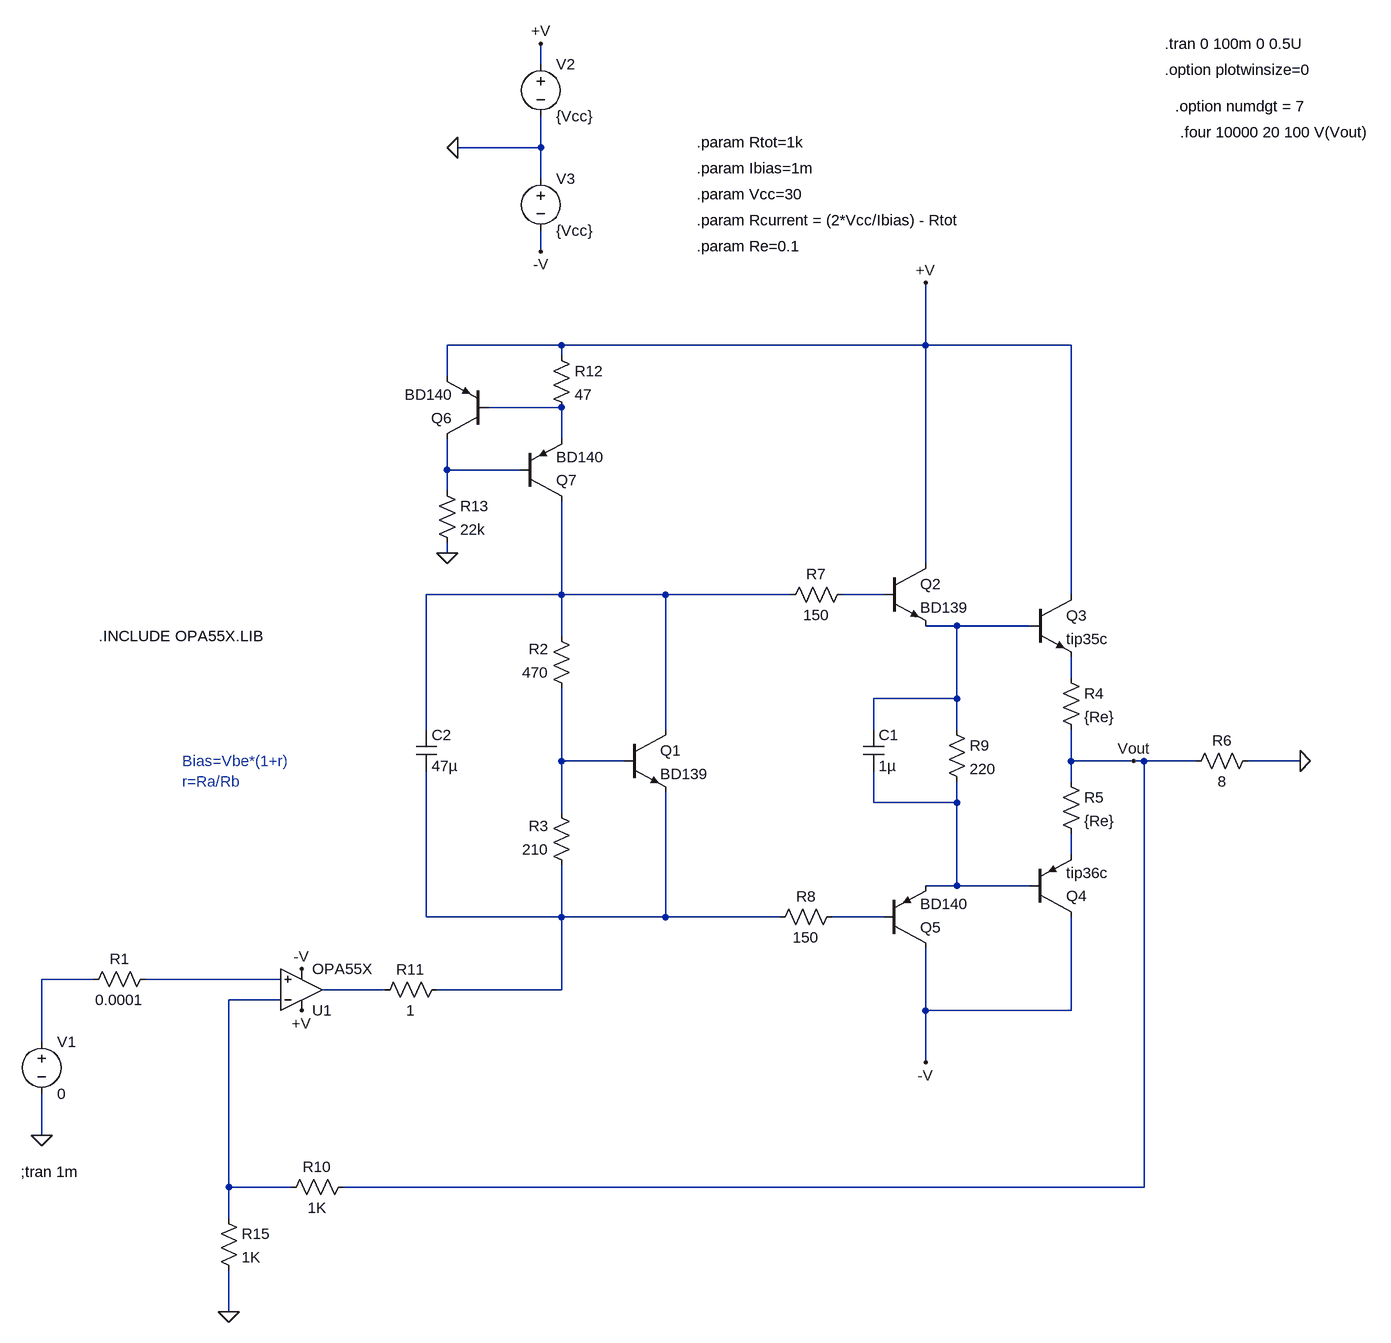
[diagram p0: schematic V2 - DC.asc]
V2 - DC.asc, the LTspice schematic file:
Version 4
SHEET 1 1144 964
WIRE -160 -976 -160 -1008
WIRE -160 -848 -160 -896
WIRE -160 -848 -288 -848
WIRE -160 -800 -160 -848
WIRE -160 -688 -160 -720
WIRE -128 -544 -304 -544
WIRE 432 -544 432 -640
WIRE 432 -544 -128 -544
WIRE 656 -544 432 -544
WIRE -128 -528 -128 -544
WIRE -304 -496 -304 -544
WIRE -128 -448 -240 -448
WIRE -128 -400 -128 -448
WIRE -304 -352 -304 -400
WIRE -192 -352 -304 -352
WIRE -304 -320 -304 -352
WIRE -304 -224 -304 -240
WIRE 432 -208 432 -544
WIRE -128 -160 -128 -304
WIRE -128 -160 -336 -160
WIRE 32 -160 -128 -160
WIRE 224 -160 32 -160
WIRE 368 -160 304 -160
WIRE 656 -160 656 -544
WIRE 480 -112 432 -112
WIRE 592 -112 480 -112
WIRE -128 -96 -128 -160
WIRE 656 -32 656 -64
WIRE 480 0 480 -112
WIRE 480 0 352 0
WIRE -336 48 -336 -160
WIRE 32 48 32 -160
WIRE 352 48 352 0
WIRE 480 48 480 0
WIRE -128 96 -128 -16
WIRE -32 96 -128 96
WIRE 656 96 656 48
WIRE 752 96 656 96
WIRE 768 96 752 96
WIRE 848 96 768 96
WIRE 1008 96 928 96
WIRE 656 128 656 96
WIRE 352 160 352 112
WIRE 480 160 480 128
WIRE 480 160 352 160
WIRE -128 176 -128 96
WIRE 656 240 656 208
WIRE 480 288 480 160
WIRE 480 288 432 288
WIRE 592 288 480 288
WIRE -336 336 -336 112
WIRE -128 336 -128 256
WIRE -128 336 -336 336
WIRE 32 336 32 144
WIRE 32 336 -128 336
WIRE 208 336 32 336
WIRE 368 336 288 336
WIRE -848 432 -928 432
WIRE -560 432 -768 432
WIRE -400 448 -496 448
WIRE -128 448 -128 336
WIRE -128 448 -320 448
WIRE -560 464 -640 464
WIRE 432 480 432 384
WIRE 656 480 656 336
WIRE 656 480 432 480
WIRE -928 528 -928 432
WIRE 432 560 432 480
WIRE -928 672 -928 608
WIRE -640 752 -640 464
WIRE -544 752 -640 752
WIRE 768 752 768 96
WIRE 768 752 -464 752
WIRE -640 800 -640 752
WIRE -640 944 -640 880
FLAG 432 -640 +V
FLAG 432 560 -V
FLAG -928 672 0
FLAG -288 -848 0
FLAG -160 -1008 +V
FLAG -160 -688 -V
FLAG 1008 96 0
FLAG 752 96 Vout
FLAG -528 480 +V
FLAG -528 416 -V
FLAG -304 -224 0
FLAG -640 944 0
SYMBOL voltage -928 512 R0
WINDOW 123 0 0 Left 0
WINDOW 39 0 0 Left 0
SYMATTR InstName V1
SYMATTR Value 0
SYMBOL res -752 416 R90
WINDOW 0 0 56 VBottom 2
WINDOW 3 32 56 VTop 2
SYMATTR InstName R1
SYMATTR Value 0.0001
SYMBOL res -112 0 R180
WINDOW 0 36 76 Left 2
WINDOW 3 36 40 Left 2
SYMATTR InstName R2
SYMATTR Value 470
SYMBOL res -112 272 R180
WINDOW 0 36 76 Left 2
WINDOW 3 36 40 Left 2
SYMATTR InstName R3
SYMATTR Value 210
SYMBOL npn -32 48 R0
SYMATTR InstName Q1
SYMATTR Value BD139
SYMBOL npn 368 -208 R0
SYMATTR InstName Q2
SYMATTR Value BD139
SYMBOL npn 592 -160 R0
SYMATTR InstName Q3
SYMATTR Value tip35c
SYMBOL pnp 592 336 M180
SYMATTR InstName Q4
SYMATTR Value tip36c
SYMBOL pnp 368 384 M180
SYMATTR InstName Q5
SYMATTR Value BD140
SYMBOL res 640 -48 R0
SYMATTR InstName R4
SYMATTR Value {Re}
SYMBOL res 640 112 R0
SYMATTR InstName R5
SYMATTR Value {Re}
SYMBOL voltage -160 -992 R0
WINDOW 123 0 0 Left 0
WINDOW 39 0 0 Left 0
SYMATTR InstName V2
SYMATTR Value {Vcc}
SYMBOL voltage -160 -816 R0
WINDOW 123 0 0 Left 0
WINDOW 39 0 0 Left 0
SYMATTR InstName V3
SYMATTR Value {Vcc}
SYMBOL res 944 80 R90
WINDOW 0 0 56 VBottom 2
WINDOW 3 32 56 VTop 2
SYMATTR InstName R6
SYMATTR Value 8
SYMBOL res 320 -176 R90
WINDOW 0 0 56 VBottom 2
WINDOW 3 32 56 VTop 2
SYMATTR InstName R7
SYMATTR Value 150
SYMBOL res 304 320 R90
WINDOW 0 0 56 VBottom 2
WINDOW 3 32 56 VTop 2
SYMATTR InstName R8
SYMATTR Value 150
SYMBOL res 464 32 R0
SYMATTR InstName R9
SYMATTR Value 220
SYMBOL cap 336 48 R0
SYMATTR InstName C1
SYMATTR Value 1µ
SYMBOL cap -352 48 R0
SYMATTR InstName C2
SYMATTR Value 47µ
SYMBOL OpAmps\\opamp2 -528 512 M180
SYMATTR InstName U1
SYMATTR Value OPA55X
SYMBOL res -448 736 R90
WINDOW 0 0 56 VBottom 2
WINDOW 3 32 56 VTop 2
SYMATTR InstName R10
SYMATTR Value 1K
SYMBOL res -304 432 R90
WINDOW 0 0 56 VBottom 2
WINDOW 3 32 56 VTop 2
SYMATTR InstName R11
SYMATTR Value 1
SYMBOL pnp -240 -400 R180
SYMATTR InstName Q6
SYMATTR Value BD140
SYMBOL res -144 -544 R0
SYMATTR InstName R12
SYMATTR Value 47
SYMBOL pnp -192 -304 M180
SYMATTR InstName Q7
SYMATTR Value BD140
SYMBOL res -320 -336 R0
SYMATTR InstName R13
SYMATTR Value 22k
SYMBOL res -656 784 R0
SYMATTR InstName R15
SYMATTR Value 1K
TEXT -712 96 Left 2 ;Bias=Vbe*(1+r)\nr=Ra/Rb
TEXT 80 -856 Left 2 !.param Rtot=1k
TEXT 80 -816 Left 2 !.param Ibias=1m
TEXT 80 -776 Left 2 !.param Vcc=30
TEXT 80 -736 Left 2 !.param Rcurrent = (2*Vcc/Ibias) - Rtot
TEXT 80 -696 Left 2 !.param Re=0.1
TEXT -960 728 Left 2 !;tran 1m
TEXT 800 -1008 Left 2 !.tran 0 100m 0 0.5U
TEXT 800 -968 Left 2 !.option plotwinsize=0
TEXT 816 -912 Left 2 !.option numdgt = 7
TEXT 824 -872 Left 2 !.four 10000 20 100 V(Vout)
TEXT -840 -96 Left 2 !.INCLUDE OPA55X.LIB

The netlist it stands for:
* V2 - DC.asc
V1 N012 0 0
R1 N013 N012 0.0001
R2 N007 N003 470
R3 N010 N007 210
Q1 N003 N007 N010 0 BD139
Q2 +V N004 N005 0 BD139
Q3 +V N005 N006 0 tip35c
Q4 -V N008 N009 0 tip36c
Q5 -V N011 N008 0 BD140
R4 N006 Vout {Re}
R5 Vout N009 {Re}
V2 +V 0 {Vcc}
V3 0 -V {Vcc}
R6 0 Vout 8
R7 N004 N003 150
R8 N011 N010 150
R9 N005 N008 220
C1 N005 N008 1µ
C2 N003 N010 47µ
XU1 N013 N015 +V -V N014 OPA55X  ; pins In+ In- V+ V- OUT
R10 Vout N015 1K
R11 N010 N014 1
Q6 N002 N001 +V 0 BD140
R12 +V N001 47
Q7 N003 N002 N001 0 BD140
R13 N002 0 22k
R15 N015 0 1K
.model NPN NPN
.model PNP PNP
.lib standard.bjt
* Bias=Vbe*(1+r)
* r=Ra/Rb
.param Rtot=1k
.param Ibias=1m
.param Vcc=30
.param Rcurrent = (2*Vcc/Ibias) - Rtot
.param Re=0.1
;tran 1m
.tran 0 100m 0 0.5U
.option plotwinsize=0
.option numdgt = 7
.four 10000 20 100 V(Vout)
.INCLUDE OPA55X.LIB
.backanno
.end